# EasyEDA schematic KegWasher_1.5_Schematic.json
TITLE: Keg Washer Pi Hat; REV: 1.5; Date: 2020-05-25; Sheet: 1/1; Drawn By: Kyle Hultman; Company: Kyle Hultman
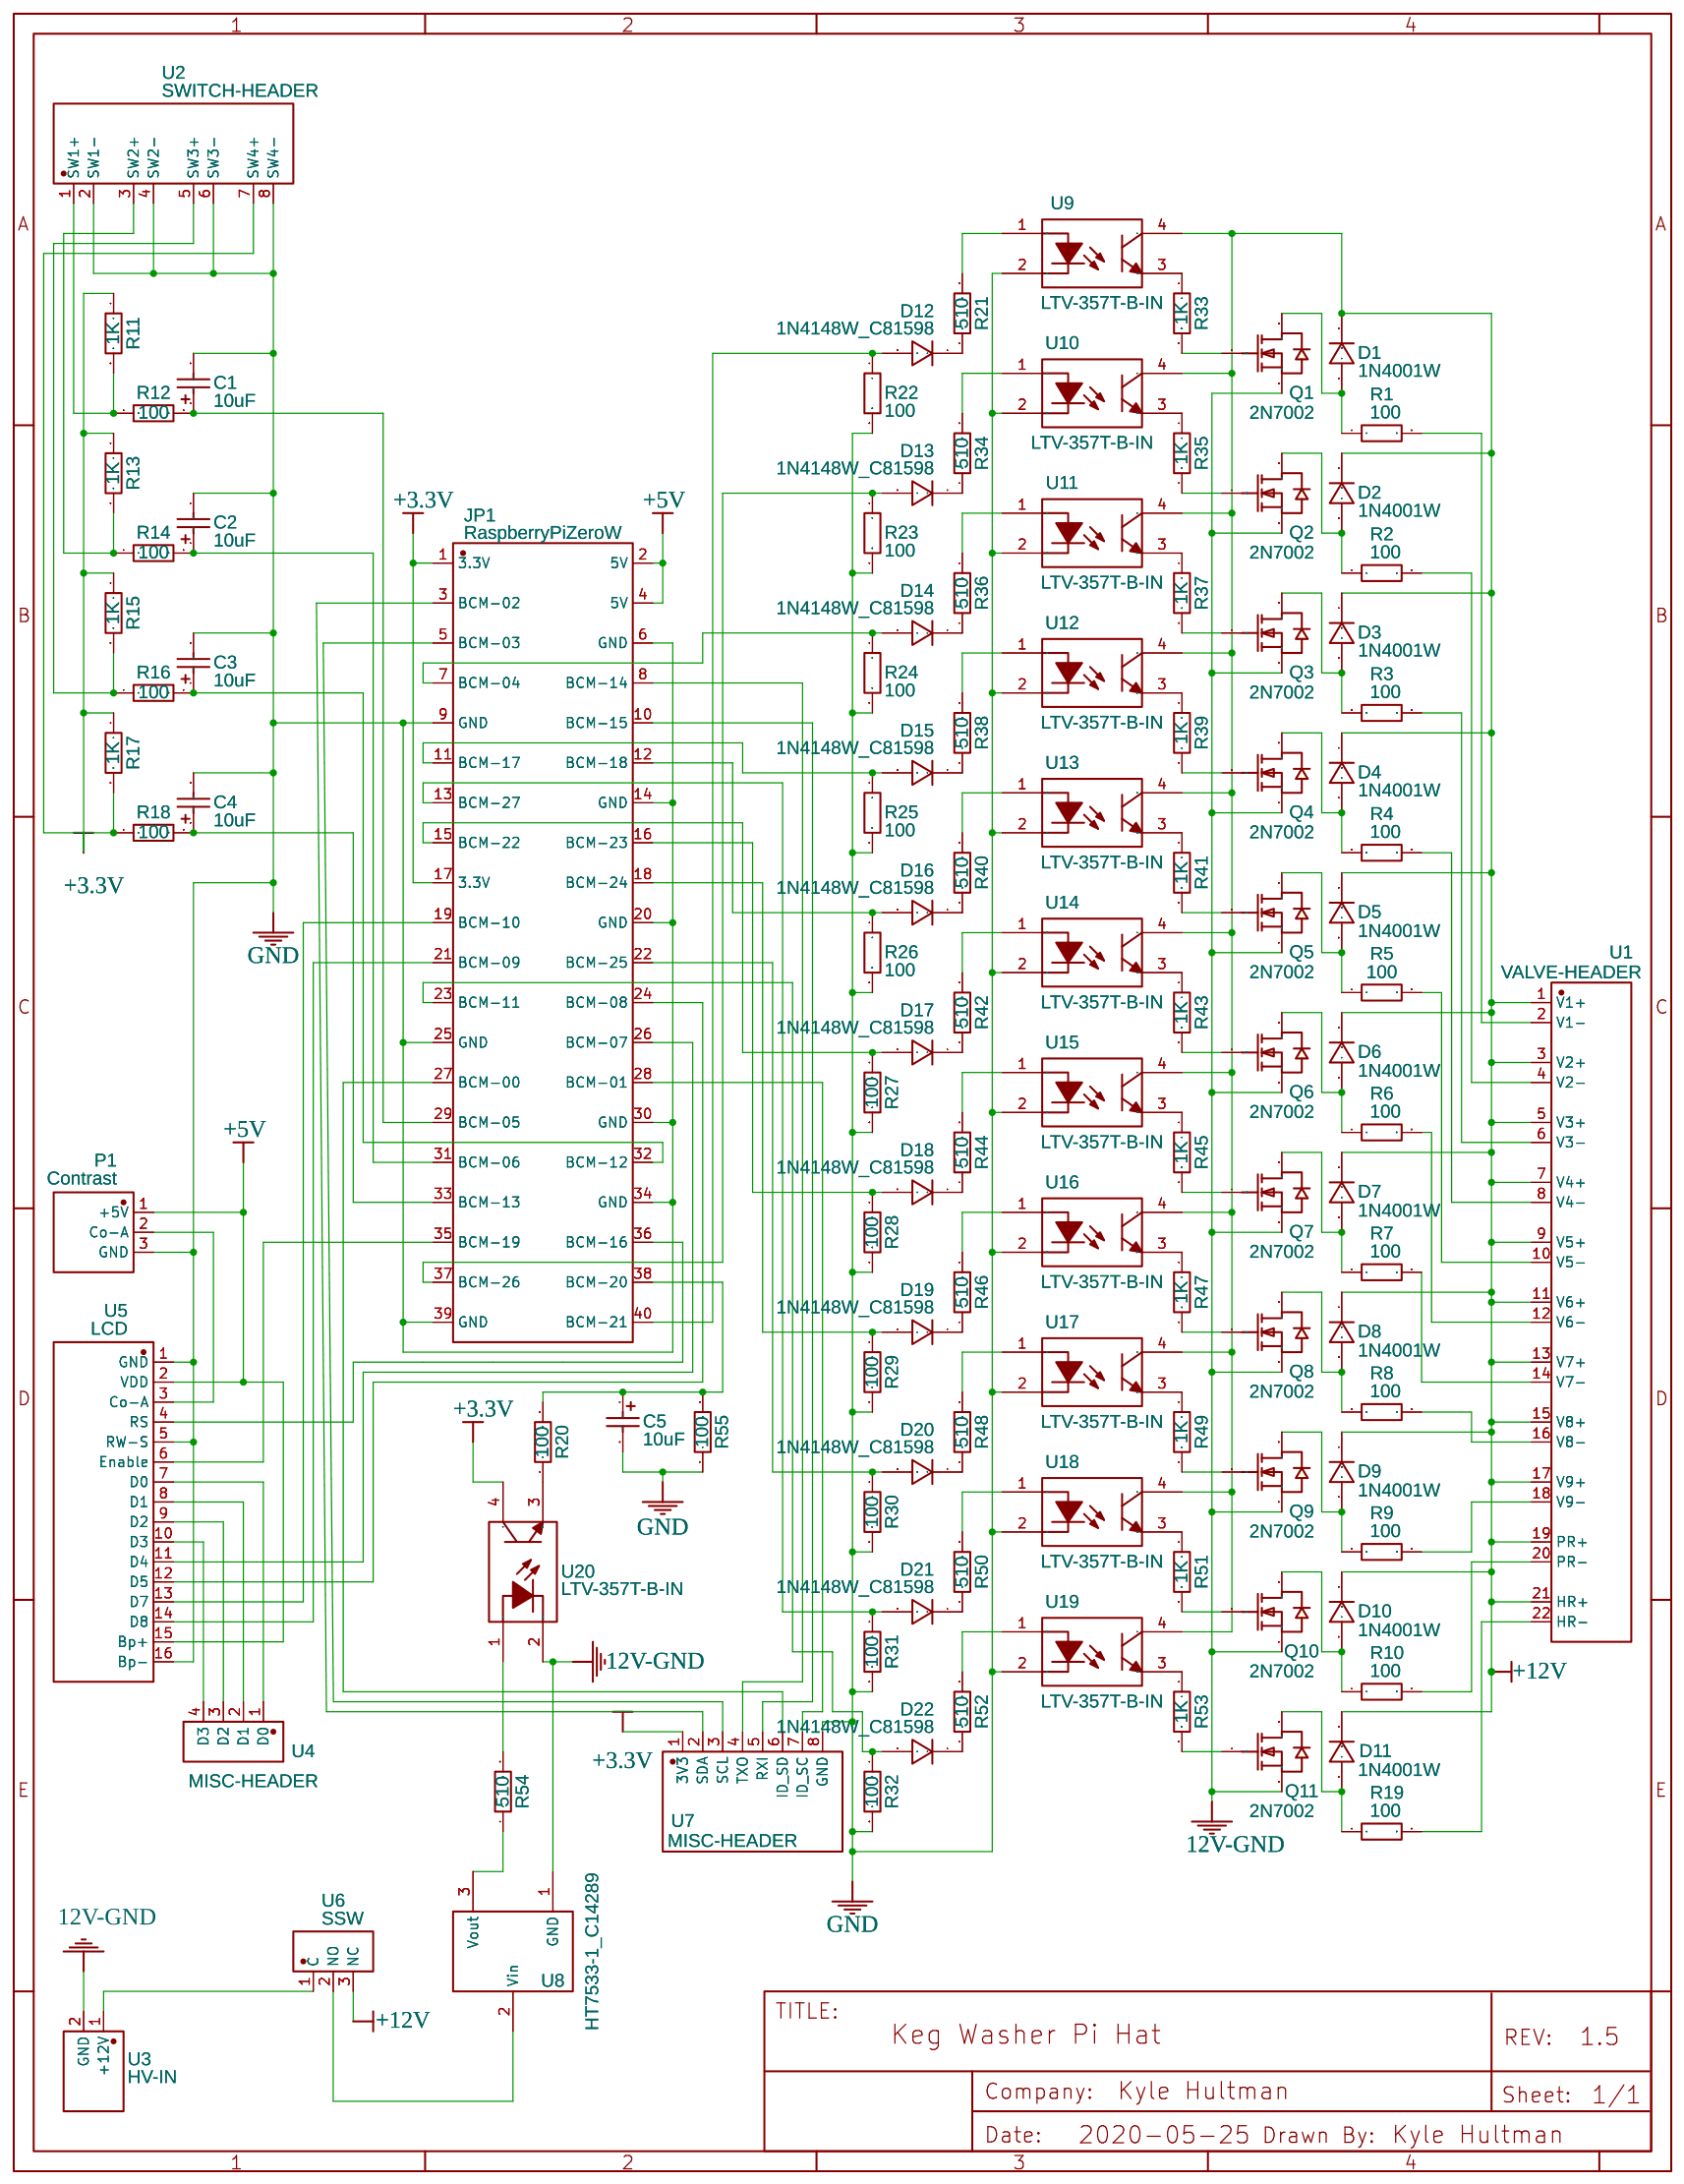
[diagram p0: schematic sheet]

## Parts
C1  10uF  [CAP-SMD_L3.2-W1.6-R-RD]
C2  10uF  [CAP-SMD_L3.2-W1.6-R-RD]
C3  10uF  [CAP-SMD_L3.2-W1.6-R-RD]
C4  10uF  [CAP-SMD_L3.2-W1.6-R-RD]
C5  10uF  [CAP-SMD_L3.2-W1.6-R-RD]
D1  1N4001W  [SOD-123F_L2.8-W1.8-LS3.7-RD]
D2  1N4001W  [SOD-123F_L2.8-W1.8-LS3.7-RD]
D3  1N4001W  [SOD-123F_L2.8-W1.8-LS3.7-RD]
D4  1N4001W  [SOD-123F_L2.8-W1.8-LS3.7-RD]
D5  1N4001W  [SOD-123F_L2.8-W1.8-LS3.7-RD]
D6  1N4001W  [SOD-123F_L2.8-W1.8-LS3.7-RD]
D7  1N4001W  [SOD-123F_L2.8-W1.8-LS3.7-RD]
D8  1N4001W  [SOD-123F_L2.8-W1.8-LS3.7-RD]
D9  1N4001W  [SOD-123F_L2.8-W1.8-LS3.7-RD]
D10  1N4001W  [SOD-123F_L2.8-W1.8-LS3.7-RD]
D11  1N4001W  [SOD-123F_L2.8-W1.8-LS3.7-RD]
D12  1N4148W_C81598  [SOD-123_L2.8-W1.8-LS3.7-RD]
D13  1N4148W_C81598  [SOD-123_L2.8-W1.8-LS3.7-RD]
D14  1N4148W_C81598  [SOD-123_L2.8-W1.8-LS3.7-RD]
D15  1N4148W_C81598  [SOD-123_L2.8-W1.8-LS3.7-RD]
D16  1N4148W_C81598  [SOD-123_L2.8-W1.8-LS3.7-RD]
D17  1N4148W_C81598  [SOD-123_L2.8-W1.8-LS3.7-RD]
D18  1N4148W_C81598  [SOD-123_L2.8-W1.8-LS3.7-RD]
D19  1N4148W_C81598  [SOD-123_L2.8-W1.8-LS3.7-RD]
D20  1N4148W_C81598  [SOD-123_L2.8-W1.8-LS3.7-RD]
D21  1N4148W_C81598  [SOD-123_L2.8-W1.8-LS3.7-RD]
D22  1N4148W_C81598  [SOD-123_L2.8-W1.8-LS3.7-RD]
JP1  RaspberryPiZeroW  [2X20-SHROUDED]
P1  Contrast  [3P]
Q1  2N7002  [SOT-23-3_L2.9-W1.3-P1.90-LS2.4-BR]
Q2  2N7002  [SOT-23-3_L2.9-W1.3-P1.90-LS2.4-BR]
Q3  2N7002  [SOT-23-3_L2.9-W1.3-P1.90-LS2.4-BR]
Q4  2N7002  [SOT-23-3_L2.9-W1.3-P1.90-LS2.4-BR]
Q5  2N7002  [SOT-23-3_L2.9-W1.3-P1.90-LS2.4-BR]
Q6  2N7002  [SOT-23-3_L2.9-W1.3-P1.90-LS2.4-BR]
Q7  2N7002  [SOT-23-3_L2.9-W1.3-P1.90-LS2.4-BR]
Q8  2N7002  [SOT-23-3_L2.9-W1.3-P1.90-LS2.4-BR]
Q9  2N7002  [SOT-23-3_L2.9-W1.3-P1.90-LS2.4-BR]
Q10  2N7002  [SOT-23-3_L2.9-W1.3-P1.90-LS2.4-BR]
Q11  2N7002  [SOT-23-3_L2.9-W1.3-P1.90-LS2.4-BR]
R1  100  [R0805]
R2  100  [R0805]
R3  100  [R0805]
R4  100  [R0805]
R5  100  [R0805]
R6  100  [R0805]
R7  100  [R0805]
R8  100  [R0805]
R9  100  [R0805]
R10  100  [R0805]
R11  1K  [R0603]
R12  100  [R0805]
R13  1K  [R0603]
R14  100  [R0805]
R15  1K  [R0603]
R16  100  [R0805]
R17  1K  [R0603]
R18  100  [R0805]
R19  100  [R0805]
R20  100  [R0805]
R21  510  [R0603]
R22  100  [R0805]
R23  100  [R0805]
R24  100  [R0805]
R25  100  [R0805]
R26  100  [R0805]
R27  100  [R0805]
R28  100  [R0805]
R29  100  [R0805]
R30  100  [R0805]
R31  100  [R0805]
R32  100  [R0805]
R33  1K  [R0603]
R34  510  [R0603]
R35  1K  [R0603]
R36  510  [R0603]
R37  1K  [R0603]
R38  510  [R0603]
R39  1K  [R0603]
R40  510  [R0603]
R41  1K  [R0603]
R42  510  [R0603]
R43  1K  [R0603]
R44  510  [R0603]
R45  1K  [R0603]
R46  510  [R0603]
R47  1K  [R0603]
R48  510  [R0603]
R49  1K  [R0603]
R50  510  [R0603]
R51  1K  [R0603]
R52  510  [R0603]
R53  1K  [R0603]
R54  510  [R0603]
R55  100  [R0805]
U1  VALVE-HEADER  [PIN_HEADER_STRAIGHT_1X22_PITCH2.54MM]
U2  SWITCH-HEADER  [HDR-M-2.54_1X8]
U3  HV-IN  [2P]
U4  MISC-HEADER  [HDR-M-2.54_1X4]
U5  LCD  [HDR-M-2.54_1X16]
U6  SSW  [3P]
U7  MISC-HEADER  [HDR-M-2.54_1X8]
U8  HT7533-1_C14289  [SOT-89-3_L4.5-W2.5-P1.50-LS4.2-BR]
U9  LTV-357T-B-IN  [SOP-4_L3.9-W4.4-P2.54-LS7.0-TL]
U10  LTV-357T-B-IN  [SOP-4_L3.9-W4.4-P2.54-LS7.0-TL]
U11  LTV-357T-B-IN  [SOP-4_L3.9-W4.4-P2.54-LS7.0-TL]
U12  LTV-357T-B-IN  [SOP-4_L3.9-W4.4-P2.54-LS7.0-TL]
U13  LTV-357T-B-IN  [SOP-4_L3.9-W4.4-P2.54-LS7.0-TL]
U14  LTV-357T-B-IN  [SOP-4_L3.9-W4.4-P2.54-LS7.0-TL]
U15  LTV-357T-B-IN  [SOP-4_L3.9-W4.4-P2.54-LS7.0-TL]
U16  LTV-357T-B-IN  [SOP-4_L3.9-W4.4-P2.54-LS7.0-TL]
U17  LTV-357T-B-IN  [SOP-4_L3.9-W4.4-P2.54-LS7.0-TL]
U18  LTV-357T-B-IN  [SOP-4_L3.9-W4.4-P2.54-LS7.0-TL]
U19  LTV-357T-B-IN  [SOP-4_L3.9-W4.4-P2.54-LS7.0-TL]
U20  LTV-357T-B-IN  [SOP-4_L3.9-W4.4-P2.54-LS7.0-TL]

## Library data of the parts
C1-C5 = TAJA106K016RNJ: Supplier: LCSC; Manufacturer: AVX; LCSC Assembly: Yes; Supplier Part: C7171; SMT Type: Basic
D1-D11 = 1N4001W: Supplier Part: C162732; Supplier: LCSC; Manufacturer: Jingdao; Contributor: LCSC; LCSC Assembly: Yes; SMT Type: Extend
D12-D22 = 1N4148W_C81598: Supplier: LCSC; Manufacturer: SEMTECH; Manufacturer Part: 1N4148W; image: //image.lceda.cn/szlcsc/C81598.jpg; Supplier Part: C81598; LCSC Assembly: Yes; SMT Type: Basic
JP1 = RaspberryPiZeroW
P1 = Contrast
Q1-Q11 = 2N7002: Supplier: LCSC; Manufacturer: CJ; LCSC Assembly: Yes; image: //image.lceda.cn/szlcsc/C8545.jpg; Supplier Part: C8545; SMT Type: Basic
R1-R10 R12 R14 R16 R18-R20 R22-R32 R55 = 0805W8F1000T5E: Supplier: LCSC; Manufacturer: UniOhm; LCSC Assembly: Yes; Supplier Part: C17408; SMT Type: Basic
R11 R13 R15 R17 R33 R35 R37 R39 R41 R43 R45 R47 R49 R51 R53 = 0603WAF1001T5E: Supplier: LCSC; Manufacturer: UniOhm; LCSC Assembly: Yes; Supplier Part: C21190; SMT Type: Basic
R21 R34 R36 R38 R40 R42 R44 R46 R48 R50 R52 R54 = 0603WAF5100T5E: Supplier: LCSC; Manufacturer: UniOhm; LCSC Assembly: Yes; Supplier Part: C23193; SMT Type: Basic
U1 = VALVE-HEADER
U2 = SWITCH-HEADER
U3 = HV-IN
U4 U7 = MISC-HEADER
U5 = LCD
U6 = SSW
U8 = HT7533-1_C14289: Supplier: LCSC; Manufacturer: HOLTEK; Manufacturer Part: HT7533-1; LCSC Assembly: Yes; image: //image.lceda.cn/szlcsc/C14289.jpg; Supplier Part: C14289; SMT Type: Basic
U9-U20 = LTV-357T-B-IN: Supplier: LCSC; Supplier Part: C406713; Manufacturer: Lite-On; Contributor: LCSC; LCSC Assembly: Yes; SMT Type: Extend

## Nets
12V-GND: Q1.2(S) Q2.2(S) Q3.2(S) Q4.2(S) Q5.2(S) Q6.2(S) Q7.2(S) Q8.2(S) Q9.2(S) Q10.2(S) Q11.2(S) U3.2(GND) U8.1(GND) U20.2
+3.3V: JP1.1(3.3V) JP1.17(3.3V) R11.1 R13.1 R15.1 R17.1 U7.1(3V3) U20.4
+5V: JP1.2(5V) JP1.4(5V) P1.1(+5V) U5.2(VDD) U5.15(Bp+)
+12V: D1.1(C) D2.1(C) D3.1(C) D4.1(C) D5.1(C) D6.1(C) D7.1(C) D8.1(C) D9.1(C) D10.1(C) D11.1(C) U1.1(V1+) U1.3(V2+) U1.5(V3+) U1.7(V4+) U1.9(V5+) U1.11(V6+) U1.13(V7+) U1.15(V8+) U1.17(V9+) U1.19(PR+) U1.21(HR+) U6.3(NC) U9.4 U10.4 U11.4 U12.4 U13.4 U14.4 U15.4 U16.4 U17.4 U18.4 U19.4
GND: C1.2 C2.2 C3.2 C4.2 C5.2 JP1.6(GND) JP1.9(GND) JP1.14(GND) JP1.20(GND) JP1.25(GND) JP1.30(GND) JP1.34(GND) JP1.39(GND) P1.3(GND) R22.2 R23.2 R24.2 R25.2 R26.2 R27.2 R28.2 R29.2 R30.2 R31.2 R32.2 R55.1 U2.2(SW1-) U2.4(SW2-) U2.6(SW3-) U2.8(SW4-) U5.1(GND) U5.5(RW-S) U5.16(Bp-) U7.8(GND) U9.2 U10.2 U11.2 U12.2 U13.2 U14.2 U15.2 U16.2 U17.2 U18.2 U19.2
Net-(C1-1): C1.1 JP1.29(BCM-05) R12.2
Net-(C2-1): C2.1 JP1.31(BCM-06) R14.2
Net-(C3-1): C3.1 JP1.32(BCM-12) R16.2
Net-(C4-1): C4.1 JP1.33(BCM-13) R18.2
Net-(C5-1): C5.1 JP1.38(BCM-20) R20.2 R55.2
Net-(D1-2): D1.2(A) Q1.3(D) R1.1
Net-(D2-2): D2.2(A) Q2.3(D) R2.1
Net-(D3-2): D3.2(A) Q3.3(D) R3.1
Net-(D4-2): D4.2(A) Q4.3(D) R4.1
Net-(D5-2): D5.2(A) Q5.3(D) R5.1
Net-(D6-2): D6.2(A) Q6.3(D) R6.1
Net-(D7-2): D7.2(A) Q7.3(D) R7.1
Net-(D8-2): D8.2(A) Q8.3(D) R8.1
Net-(D9-2): D9.2(A) Q9.3(D) R9.1
Net-(D10-2): D10.2(A) Q10.3(D) R10.1
Net-(D11-2): D11.2(A) Q11.3(D) R19.1
Net-(D12-1): D12.1(K) R21.1
Net-(D12-2): D12.2(A) JP1.40(BCM-21) R22.1
Net-(D13-1): D13.1(K) R34.1
Net-(D13-2): D13.2(A) JP1.37(BCM-26) R23.1
Net-(D14-1): D14.1(K) R36.1
Net-(D14-2): D14.2(A) JP1.7(BCM-04) R24.1
Net-(D15-1): D15.1(K) R38.1
Net-(D15-2): D15.2(A) JP1.11(BCM-17) R25.1
Net-(D16-1): D16.1(K) R40.1
Net-(D16-2): D16.2(A) JP1.12(BCM-18) R26.1
Net-(D17-1): D17.1(K) R42.1
Net-(D17-2): D17.2(A) JP1.15(BCM-22) R27.1
Net-(D18-1): D18.1(K) R44.1
Net-(D18-2): D18.2(A) JP1.16(BCM-23) R28.1
Net-(D19-1): D19.1(K) R46.1
Net-(D19-2): D19.2(A) JP1.18(BCM-24) R29.1
Net-(D20-1): D20.1(K) R48.1
Net-(D20-2): D20.2(A) JP1.22(BCM-25) R30.1
Net-(D21-1): D21.1(K) R50.1
Net-(D21-2): D21.2(A) JP1.13(BCM-27) R31.1
Net-(D22-1): D22.1(K) R52.1
Net-(D22-2): D22.2(A) JP1.23(BCM-11) R32.1
Net-(JP1-3): JP1.3(BCM-02) U7.2(SDA)
Net-(JP1-5): JP1.5(BCM-03) U7.3(SCL)
Net-(JP1-8): JP1.8(BCM-14) U7.4(TXO)
Net-(JP1-10): JP1.10(BCM-15) U7.5(RXI)
Net-(JP1-19): JP1.19(BCM-10) U5.13(D7)
Net-(JP1-21): JP1.21(BCM-09) U5.14(D8)
Net-(JP1-24): JP1.24(BCM-08) U5.12(D5)
Net-(JP1-26): JP1.26(BCM-07) U5.11(D4)
Net-(JP1-27): JP1.27(BCM-00) U7.6(ID_SD)
Net-(JP1-28): JP1.28(BCM-01) U7.7(ID_SC)
Net-(JP1-35): JP1.35(BCM-19) U5.6(Enable)
Net-(JP1-36): JP1.36(BCM-16) U5.4(RS)
Net-(P1-2): P1.2(Co-A) U5.3(Co-A)
Net-(Q1-1): Q1.1(G) R33.2
Net-(Q2-1): Q2.1(G) R35.2
Net-(Q3-1): Q3.1(G) R37.2
Net-(Q4-1): Q4.1(G) R39.2
Net-(Q5-1): Q5.1(G) R41.2
Net-(Q6-1): Q6.1(G) R43.2
Net-(Q7-1): Q7.1(G) R45.2
Net-(Q8-1): Q8.1(G) R47.2
Net-(Q9-1): Q9.1(G) R49.2
Net-(Q10-1): Q10.1(G) R51.2
Net-(Q11-1): Q11.1(G) R53.2
Net-(R1-2): R1.2 U1.2(V1-)
Net-(R2-2): R2.2 U1.4(V2-)
Net-(R3-2): R3.2 U1.6(V3-)
Net-(R4-2): R4.2 U1.8(V4-)
Net-(R5-2): R5.2 U1.10(V5-)
Net-(R6-2): R6.2 U1.12(V6-)
Net-(R7-2): R7.2 U1.14(V7-)
Net-(R8-2): R8.2 U1.16(V8-)
Net-(R9-2): R9.2 U1.18(V9-)
Net-(R10-2): R10.2 U1.20(PR-)
Net-(R11-2): R11.2 R12.1 U2.1(SW1+)
Net-(R13-2): R13.2 R14.1 U2.3(SW2+)
Net-(R15-2): R15.2 R16.1 U2.5(SW3+)
Net-(R17-2): R17.2 R18.1 U2.7(SW4+)
Net-(R19-2): R19.2 U1.22(HR-)
Net-(R20-1): R20.1 U20.3
Net-(R21-2): R21.2 U9.1
Net-(R33-1): R33.1 U9.3
Net-(R34-2): R34.2 U10.1
Net-(R35-1): R35.1 U10.3
Net-(R36-2): R36.2 U11.1
Net-(R37-1): R37.1 U11.3
Net-(R38-2): R38.2 U12.1
Net-(R39-1): R39.1 U12.3
Net-(R40-2): R40.2 U13.1
Net-(R41-1): R41.1 U13.3
Net-(R42-2): R42.2 U14.1
Net-(R43-1): R43.1 U14.3
Net-(R44-2): R44.2 U15.1
Net-(R45-1): R45.1 U15.3
Net-(R46-2): R46.2 U16.1
Net-(R47-1): R47.1 U16.3
Net-(R48-2): R48.2 U17.1
Net-(R49-1): R49.1 U17.3
Net-(R50-2): R50.2 U18.1
Net-(R51-1): R51.1 U18.3
Net-(R52-2): R52.2 U19.1
Net-(R53-1): R53.1 U19.3
Net-(R54-1): R54.1 U8.3(Vout)
Net-(R54-2): R54.2 U20.1
Net-(U3-1): U3.1(+12V) U6.1(C)
Net-(U4-1): U4.1(D0) U5.7(D0)
Net-(U4-2): U4.2(D1) U5.8(D1)
Net-(U4-3): U4.3(D2) U5.9(D2)
Net-(U4-4): U4.4(D3) U5.10(D3)
Net-(U6-2): U6.2(NO) U8.2(Vin)
